# EasyEDA schematic SCH_单片机课设_2025-06-27.json
TITLE: Sheet_1; REV: 1.0; Date: 2024-12-09; Sheet: 1/1; Drawn By: linzhaoxian; Company: Your Company
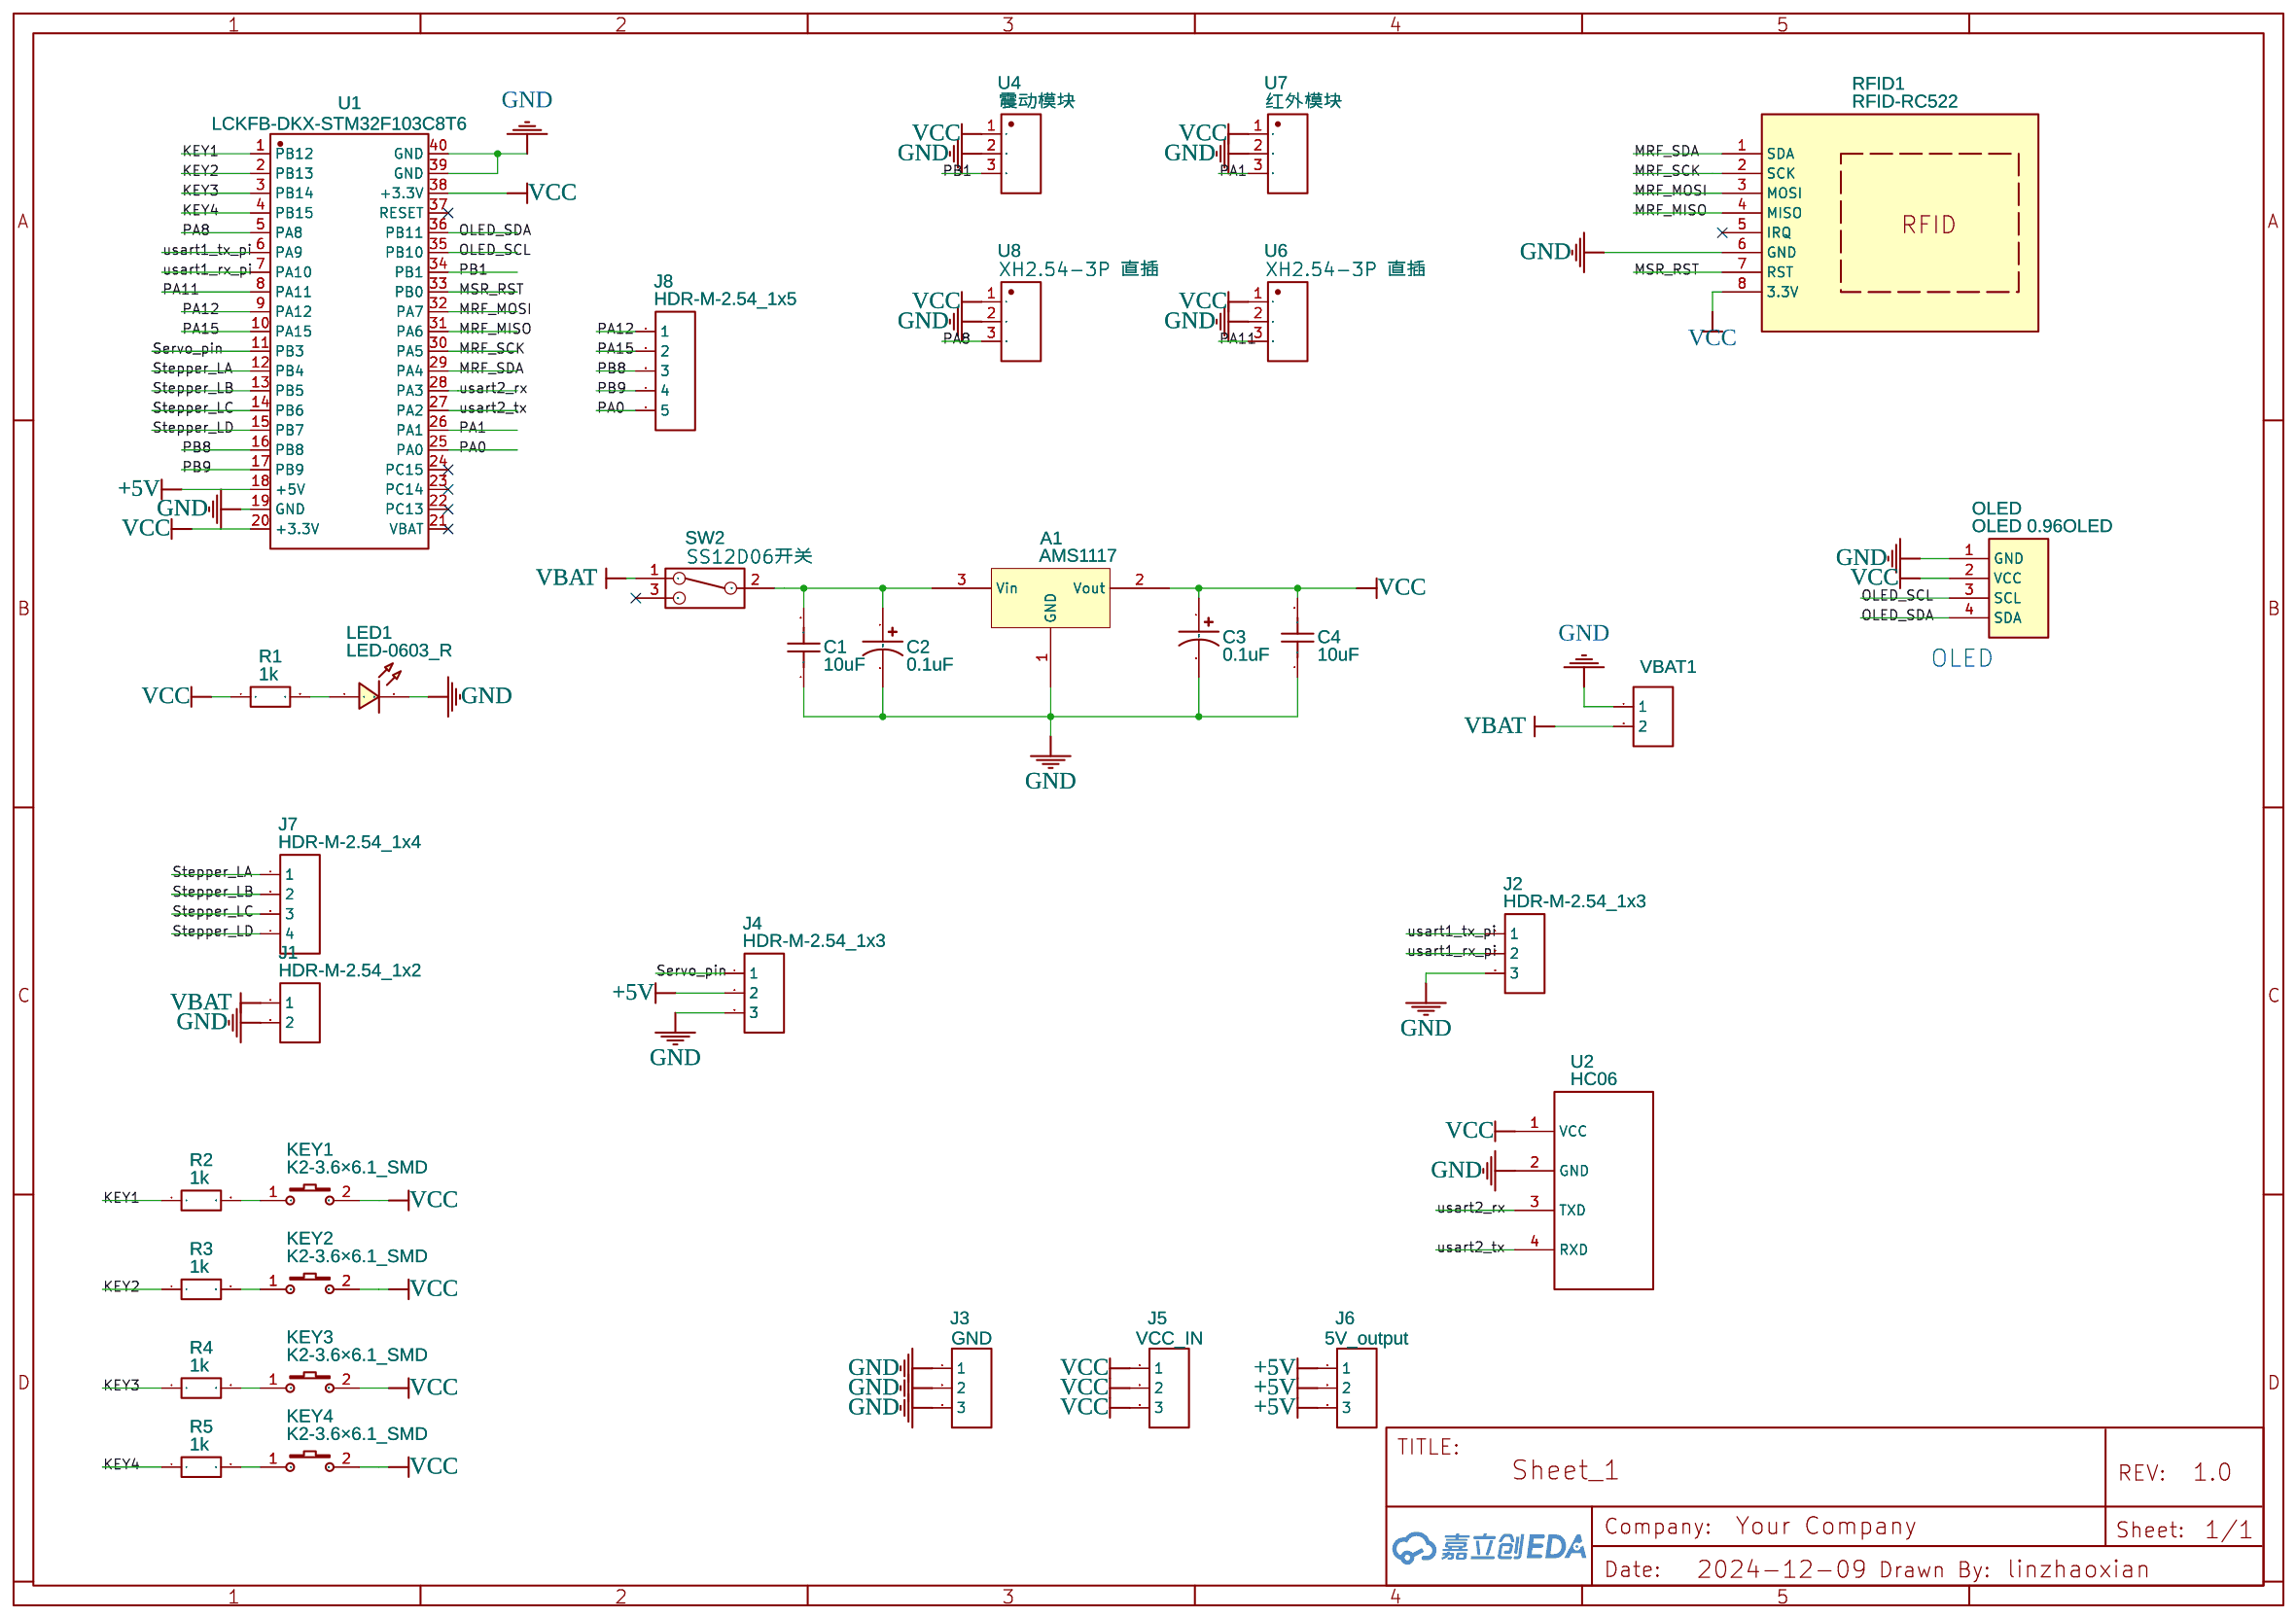
[diagram p0: schematic sheet]

## Parts
A1  AMS1117  [AMS1117]
C1  10uF  [C0603]
C2  0.1uF  [CASE-A_3216]
C3  0.1uF  [CASE-A_3216]
C4  10uF  [C0603]
J1  HDR-M-2.54_1x2  [HDR-M-2.54_1X2]
J2  HDR-M-2.54_1x3  [HDR-M-2.54_1X3]
J3  GND  [HDR-M-2.54_1X3]
J4  HDR-M-2.54_1x3  [HDR-M-2.54_1X3]
J5  VCC_IN  [HDR-M-2.54_1X3]
J6  5V_output  [HDR-M-2.54_1X3]
J7  HDR-M-2.54_1x4  [HDR-M-2.54_1X4]
J8  HDR-M-2.54_1x5  [HDR-M-2.54_1X5]
KEY1  K2-3.6×6.1_SMD  [KEY-SMD_2P-L6.2-W3.6-LS8.0]
KEY2  K2-3.6×6.1_SMD  [KEY-SMD_2P-L6.2-W3.6-LS8.0]
KEY3  K2-3.6×6.1_SMD  [KEY-SMD_2P-L6.2-W3.6-LS8.0]
KEY4  K2-3.6×6.1_SMD  [KEY-SMD_2P-L6.2-W3.6-LS8.0]
LED1  LED-0603_R  [LED0603_RED]
OLED  OLED 0.96OLED  [OLED10.96OLED]
R1  1k  [R0603]
R2  1k  [R0603]
R3  1k  [R0603]
R4  1k  [R0603]
R5  1k  [R0603]
RFID1  RFID-RC522  [RFID-RC522A-MODULE]
SW2  SS12D06开关  [SS12D06开关]
U1  LCKFB-DKX-STM32F103C8T6  [CONN-TH_L53.3-W22.9_STM32F103C8T6-CARD]
U2  HC06  [PCB_HC06]
U4  震动模块  [XH2.54-3P 直插]
U6  XH2.54-3P 直插  [XH2.54-3P 直插]
U7  红外模块  [XH2.54-3P 直插]
U8  XH2.54-3P 直插  [XH2.54-3P 直插]
VBAT1  端子  [CONN-TH_2P-P5.00]

## Library data of the parts
A1 = AMS1117: Contributor: 13319187hyp
C1 C4 = C_0603_US: Contributor: LCEDA_Lib
C2 C3 = C_Tan_SMD_A_US: Contributor: LCEDA_Lib
J1 = HDR-M-2.54_1x2: Supplier Part: C124375; Supplier: LCSC; Contributor: LCEDA_Lib
J2-J6 = HDR-M-2.54_1x3: Supplier Part: C180248; Supplier: LCSC; Contributor: LCEDA_Lib
J7 = HDR-M-2.54_1x4: Supplier Part: C124378; Supplier: LCSC; Contributor: LCEDA_Lib
J8 = HDR-M-2.54_1x5: Supplier Part: C358687; Supplier: LCSC; Contributor: LCEDA_Lib
KEY1-KEY4 = K2-3.6×6.1_SMD: Supplier Part: C118141; Supplier: LCSC; Manufacturer Part: K2-1107ST-A4SW-06; Contributor: LCEDA_Lib; 制造商: 韩国韩荣
LED1 = LED-0603_R: Manufacturer: EVERLIGHT(台湾亿光); Manufacturer Part: 19-217/R6C-AL1M2VY/3T; Supplier Part: C72044; Supplier: LCSC; Contributor: LCEDA_01
OLED = OLED 0.96OLED: Contributor: substantiv
R1-R5 = R_0805_EU: Contributor: LCEDA_Lib
RFID1 = RFID-RC522: Contributor: wwppp; sourceId: cnhDbxPIC
SW2 = SS12D06开关: Contributor: lanjl
U1 = LCKFB-DKX-STM32F103C8T6: Supplier: LCSC; Supplier Part: C22396880; Manufacturer: 立创开发板; Contributor: lcsc; JLCPCB Part Class: Extended Part
U2 = HC06: Contributor: pauloandrezc
U4 U6-U8 = XH2.54-3P 直插: Supplier: LCSC; Supplier Part: C9900000727; Manufacturer: null; JLCPCB Part Class: Extended Part; Contributor: zzxc
VBAT1 = CONN-TH_2P-P5.00: Supplier: LCSC; Contributor: south0829

## Nets
+5V: J4.2 J6.1 J6.2 J6.3 U1.18(+5V)
GND: A1.1(GND) C1.1 C2.2 C3.2 C4.1 J1.2 J2.3 J3.1 J3.2 J3.3 J4.3 LED1.2 OLED.1(GND) RFID1.6(GND) U1.19(GND) U1.39(GND) U1.40(GND) U2.2(GND) U4.2 U6.2 U7.2 U8.2 VBAT1.1
VBAT: J1.1 SW2.1 VBAT1.2
VCC: A1.2(Vout) C3.1 C4.2 J5.1 J5.2 J5.3 KEY1.2 KEY2.2 KEY3.2 KEY4.2 OLED.2(VCC) R1.1 RFID1.8(3.3V) U1.20(+3.3V) U1.38(+3.3V) U2.1(VCC) U4.1 U6.1 U7.1 U8.1
KEY1: R2.1 U1.1(PB12)
KEY2: R3.1 U1.2(PB13)
KEY3: R4.1 U1.3(PB14)
KEY4: R5.1 U1.4(PB15)
MRF_MISO: RFID1.4(MISO) U1.31(PA6)
MRF_MOSI: RFID1.3(MOSI) U1.32(PA7)
MRF_SCK: RFID1.2(SCK) U1.30(PA5)
MRF_SDA: RFID1.1(SDA) U1.29(PA4)
MSR_RST: RFID1.7(RST) U1.33(PB0)
OLED_SCL: OLED.3(SCL) U1.35(PB10)
OLED_SDA: OLED.4(SDA) U1.36(PB11)
PA0: J8.5 U1.25(PA0)
PA1: U1.26(PA1) U7.3
PA8: U1.5(PA8) U8.3
PA11: U1.8(PA11) U6.3
PA12: J8.1 U1.9(PA12)
PA15: J8.2 U1.10(PA15)
PB1: U1.34(PB1) U4.3
PB8: J8.3 U1.16(PB8)
PB9: J8.4 U1.17(PB9)
Servo_pin: J4.1 U1.11(PB3)
Stepper_LA: J7.1 U1.12(PB4)
Stepper_LB: J7.2 U1.13(PB5)
Stepper_LC: J7.3 U1.14(PB6)
Stepper_LD: J7.4 U1.15(PB7)
usart1_rx_pi: J2.2 U1.7(PA10)
usart1_tx_pi: J2.1 U1.6(PA9)
usart2_rx: U1.28(PA3) U2.3(TXD)
usart2_tx: U1.27(PA2) U2.4(RXD)
Net-(A1-3): A1.3(Vin) C1.2 C2.1 SW2.2
Net-(KEY1-1): KEY1.1 R2.2
Net-(KEY2-1): KEY2.1 R3.2
Net-(KEY3-1): KEY3.1 R4.2
Net-(KEY4-1): KEY4.1 R5.2
Net-(LED1-1): LED1.1 R1.2

Not connected (* = marked no-connect by the designer): RFID1 5(IRQ)*; SW2 3*; U1 21(VBAT)* 22(PC13)* 23(PC14)* 24(PC15)* 37(RESET)*

## Notes on the sheet
- OLED
